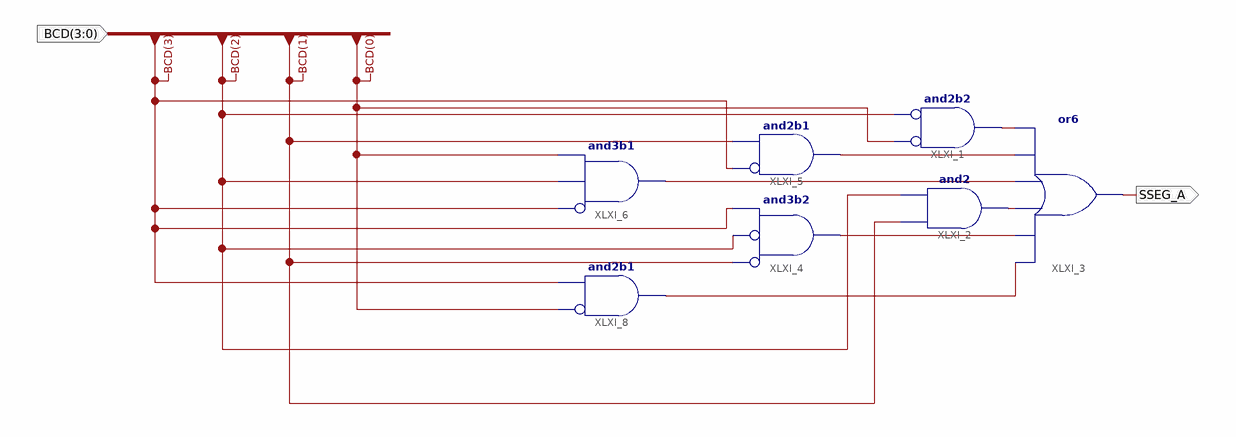
[diagram p0: schematic sheet 1]
// Xilinx ISE schematic SSEG_A.sch (spartan6) as structural Verilog: 7 symbols, 2 ports
module SSEG_A (
  input  [3:0] BCD,
  output SSEG_A
);

  wire XLXN_2, XLXN_3, XLXN_4, XLXN_6, XLXN_7, XLXN_8;

  and XLXI_1 (XLXN_6, ~BCD[0], ~BCD[2]);  // and2b2
  and XLXI_2 (XLXN_4, BCD[1], BCD[2]);
  or XLXI_3 (SSEG_A, XLXN_8, XLXN_7, XLXN_4, XLXN_3, XLXN_2, XLXN_6);
  and XLXI_4 (XLXN_7, ~BCD[1], ~BCD[2], BCD[3]);  // and3b2
  and XLXI_5 (XLXN_2, ~BCD[3], BCD[1]);  // and2b1
  and XLXI_6 (XLXN_3, ~BCD[3], BCD[2], BCD[0]);  // and3b1
  and XLXI_8 (XLXN_8, ~BCD[0], BCD[3]);  // and2b1
endmodule
